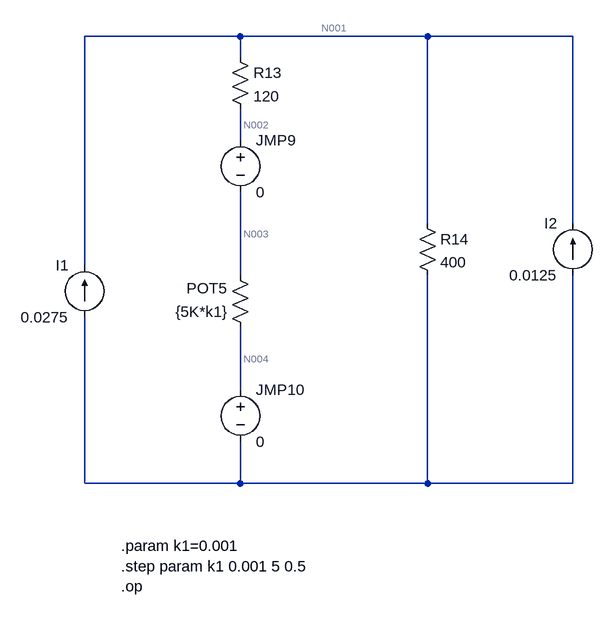
[diagram p0: schematic 53.asc]
53.asc, the LTspice schematic file:
Version 4.1
SHEET 1 880 680
WIRE 272 -208 32 -208
WIRE 560 -208 272 -208
WIRE 784 -208 560 -208
WIRE 272 -176 272 -208
WIRE 272 -48 272 -96
WIRE 560 80 560 -208
WIRE 784 80 784 -208
WIRE 32 144 32 -208
WIRE 272 160 272 32
WIRE 272 336 272 240
WIRE 32 480 32 224
WIRE 272 480 272 416
WIRE 272 480 32 480
WIRE 560 480 560 160
WIRE 560 480 272 480
WIRE 784 480 784 160
WIRE 784 480 560 480
SYMBOL voltage 272 -64 R0
SYMATTR InstName JMP9
SYMATTR Value 0
SYMBOL voltage 272 320 R0
SYMATTR InstName JMP10
SYMATTR Value 0
SYMBOL res 288 256 R180
WINDOW 0 36 76 Left 2
WINDOW 3 36 40 Left 2
SYMATTR InstName POT5
SYMATTR Value {5K*k1}
SYMBOL current 32 224 R180
WINDOW 0 24 80 Left 2
WINDOW 3 24 0 Left 2
SYMATTR InstName I1
SYMATTR Value 0.0275
SYMBOL res 256 -192 R0
SYMATTR InstName R13
SYMATTR Value 120
SYMBOL current 784 160 R180
WINDOW 0 24 80 Left 2
WINDOW 3 24 0 Left 2
SYMATTR InstName I2
SYMATTR Value 0.0125
SYMBOL res 544 64 R0
SYMATTR InstName R14
SYMATTR Value 400
TEXT 88 576 Left 2 !.param k1=0.001\n.step param k1 0.001 5 0.5\n.op

The netlist it stands for:
* 53.asc
V§JMP9 N002 N003 0
V§JMP10 N004 N005 0
R§POT5 N004 N003 {5K*k1}
I1 N005 N001 0.0275
R13 N001 N002 120
I2 N005 N001 0.0125
R14 N001 N005 400
.param k1=0.001
.step param k1 0.001 5 0.5
.op
.backanno
.end

* Results of the author's LTspice run, read from the files saved beside the schematic
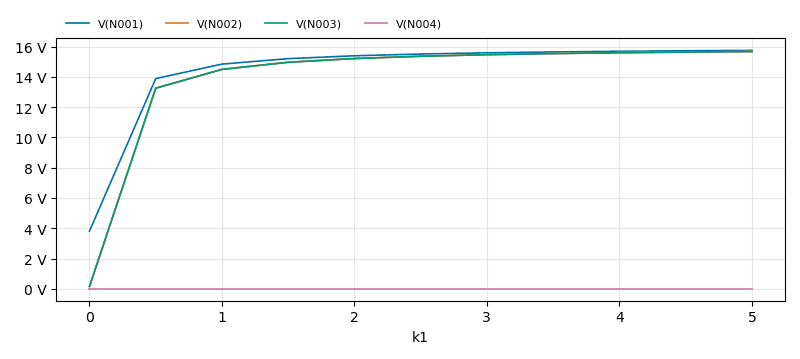
[diagram p1: Operating Point of 53.asc, plotted from the saved traces]
* Operating Point, 1 run:
*   V(N001): 3.81 V at k1=1 m, 15.75 V at k1=5 , min 3.81 V, max 15.75 V
*   V(N002): 152.4 mV at k1=1 m, 15.67 V at k1=5 , min 152.4 mV, max 15.67 V
*   V(N003): 152.4 mV at k1=1 m, 15.67 V at k1=5 , min 152.4 mV, max 15.67 V
*   V(N004): 0 V at k1=1 m, 0 V at k1=5 , min -3.009e-09 fV, max 0 V